# Altium schematic sheet FrontPlate.SchDoc
size A4
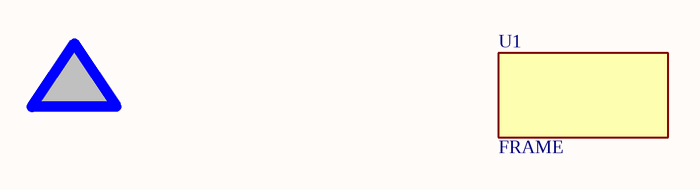
[diagram p0: FrontPlate.SchDoc]

## Parts
1  Warning  [Warning]  (value not drawn)
U1  FRAME  [FRAME]